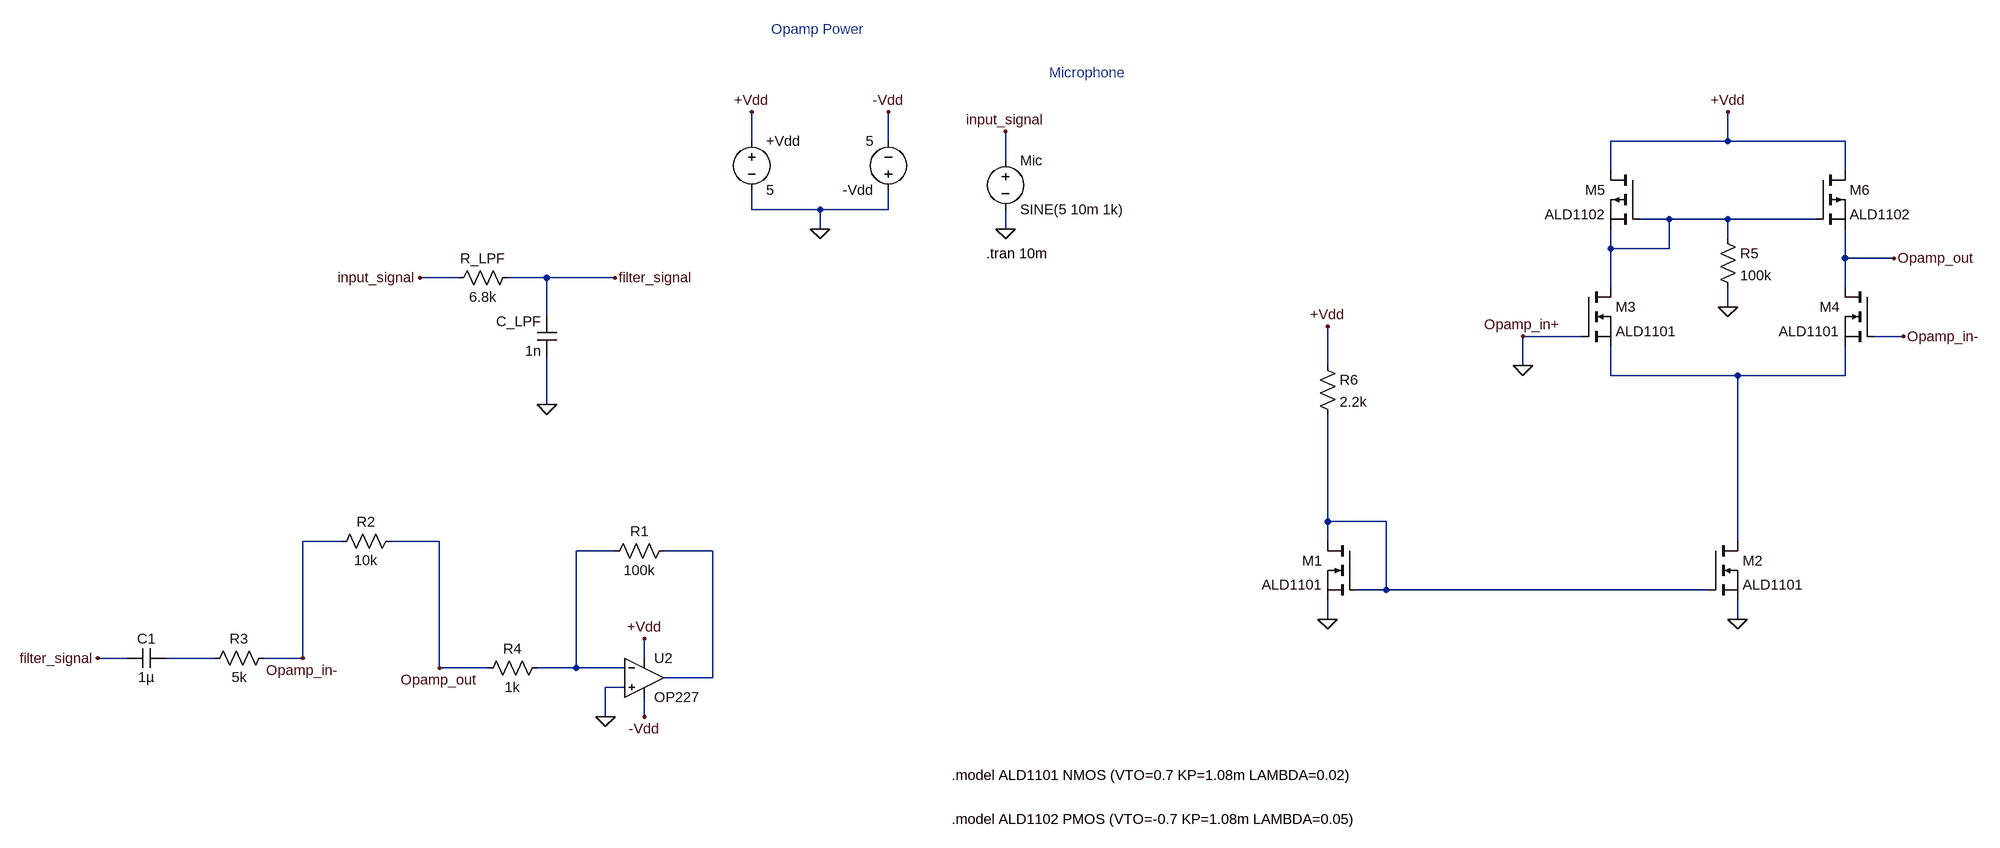
[diagram p0: schematic FinalProject_v2.asc]
FinalProject_v2.asc, the LTspice schematic file:
Version 4
SHEET 1 3908 1028
WIRE 576 -208 576 -256
WIRE 800 -208 800 -256
WIRE 2176 -208 2176 -256
WIRE 2176 -208 1984 -208
WIRE 2368 -208 2176 -208
WIRE 992 -176 992 -224
WIRE 1984 -160 1984 -208
WIRE 2368 -160 2368 -208
WIRE 576 -96 576 -128
WIRE 688 -96 576 -96
WIRE 800 -96 800 -128
WIRE 800 -96 688 -96
WIRE 2080 -80 2032 -80
WIRE 2176 -80 2080 -80
WIRE 2320 -80 2176 -80
WIRE 688 -64 688 -96
WIRE 992 -64 992 -96
WIRE 2176 -48 2176 -80
WIRE 1984 -32 1984 -64
WIRE 2080 -32 2080 -80
WIRE 2080 -32 1984 -32
WIRE 2368 -16 2368 -64
WIRE 2448 -16 2368 -16
WIRE 96 16 32 16
WIRE 240 16 176 16
WIRE 352 16 240 16
WIRE 1984 32 1984 -32
WIRE 2368 32 2368 -16
WIRE 2176 64 2176 32
WIRE 240 80 240 16
WIRE 1936 112 1840 112
WIRE 2464 112 2416 112
WIRE 1520 160 1520 96
WIRE 1840 160 1840 112
WIRE 1984 176 1984 128
WIRE 2192 176 1984 176
WIRE 2368 176 2368 128
WIRE 2368 176 2192 176
WIRE 240 224 240 144
WIRE 1520 416 1520 240
WIRE 1616 416 1520 416
WIRE -96 448 -160 448
WIRE 64 448 -16 448
WIRE 1520 448 1520 416
WIRE 2192 448 2192 176
WIRE 352 464 288 464
WIRE 512 464 432 464
WIRE 1616 528 1616 416
WIRE 1616 528 1568 528
WIRE 2144 528 1616 528
WIRE 1520 576 1520 544
WIRE 2192 576 2192 544
WIRE -448 640 -496 640
WIRE -304 640 -384 640
WIRE -160 640 -160 448
WIRE -160 640 -224 640
WIRE 400 640 400 608
WIRE 64 656 64 448
WIRE 144 656 64 656
WIRE 288 656 288 464
WIRE 288 656 224 656
WIRE 368 656 288 656
WIRE 512 672 512 464
WIRE 512 672 432 672
WIRE 368 688 336 688
WIRE 336 736 336 688
WIRE 400 736 400 704
FLAG 688 -64 0
FLAG 576 -256 +Vdd
FLAG 800 -256 -Vdd
FLAG 336 736 0
FLAG 400 608 +Vdd
FLAG 400 736 -Vdd
FLAG 992 -64 0
FLAG 992 -224 input_signal
FLAG 352 16 filter_signal
FLAG 32 16 input_signal
FLAG 240 224 0
FLAG -496 640 filter_signal
FLAG 2448 -16 Opamp_out
FLAG 1840 160 0
FLAG 2464 112 Opamp_in-
FLAG 64 656 Opamp_out
FLAG -160 640 Opamp_in-
FLAG 2176 -256 +Vdd
FLAG 1840 112 Opamp_in+
FLAG 1520 96 +Vdd
FLAG 1520 576 0
FLAG 2192 576 0
FLAG 2176 64 0
DATAFLAG 2192 320 "Id(M2)"
DATAFLAG 1520 336 "Id(M1)"
SYMBOL voltage 576 -224 R0
WINDOW 123 0 0 Left 0
WINDOW 39 0 0 Left 0
SYMATTR InstName +Vdd
SYMATTR Value 5
SYMBOL voltage 800 -112 R180
WINDOW 123 0 0 Left 0
WINDOW 39 0 0 Left 0
SYMATTR InstName -Vdd
SYMATTR Value 5
SYMBOL res 0 432 R90
WINDOW 0 0 56 VBottom 2
WINDOW 3 32 56 VTop 2
SYMATTR InstName R2
SYMATTR Value 10k
SYMBOL res -208 624 R90
WINDOW 0 0 56 VBottom 2
WINDOW 3 32 56 VTop 2
SYMATTR InstName R3
SYMATTR Value 5k
SYMBOL OpAmps\\OP227 400 608 R0
SYMATTR InstName U2
SYMBOL res 448 448 R90
WINDOW 0 0 56 VBottom 2
WINDOW 3 32 56 VTop 2
SYMATTR InstName R1
SYMATTR Value 100k
SYMBOL res 240 640 R90
WINDOW 0 0 56 VBottom 2
WINDOW 3 32 56 VTop 2
SYMATTR InstName R4
SYMATTR Value 1k
SYMBOL cap -384 624 R90
WINDOW 0 0 32 VBottom 2
WINDOW 3 32 32 VTop 2
SYMATTR InstName C1
SYMATTR Value 1µ
SYMBOL voltage 992 -192 R0
WINDOW 123 24 124 Left 2
WINDOW 39 0 0 Left 0
SYMATTR InstName Mic
SYMATTR Value SINE(5 10m 1k)
SYMBOL cap 256 144 R180
WINDOW 0 24 56 Left 2
WINDOW 3 24 8 Left 2
SYMATTR InstName C_LPF
SYMATTR Value 1n
SYMBOL res 192 0 R90
WINDOW 0 0 56 VBottom 2
WINDOW 3 32 56 VTop 2
SYMATTR InstName R_LPF
SYMATTR Value 6.8k
SYMBOL pmos 2032 -160 M0
SYMATTR InstName M5
SYMATTR Value ALD1102
SYMBOL pmos 2320 -160 R0
SYMATTR InstName M6
SYMATTR Value ALD1102
SYMBOL res 1504 144 R0
SYMATTR InstName R6
SYMATTR Value 2.2k
SYMBOL nmos 1568 448 M0
SYMATTR InstName M1
SYMATTR Value ALD1101
SYMBOL nmos 2144 448 R0
SYMATTR InstName M2
SYMATTR Value ALD1101
SYMBOL nmos 1936 32 R0
SYMATTR InstName M3
SYMATTR Value ALD1101
SYMBOL nmos 2416 32 M0
SYMATTR InstName M4
SYMATTR Value ALD1101
SYMBOL res 2160 -64 R0
SYMATTR InstName R5
SYMATTR Value 100k
TEXT 960 -24 Left 2 !.tran 10m
TEXT 1064 -320 Left 2 ;Microphone
TEXT 608 -392 Left 2 ;Opamp Power
TEXT 904 904 Left 2 !.model ALD1102 PMOS (VTO=-0.7 KP=1.08m LAMBDA=0.05)
TEXT 904 832 Left 2 !.model ALD1101 NMOS (VTO=0.7 KP=1.08m LAMBDA=0.02)

The netlist it stands for:
* FinalProject_v2.asc
V§+Vdd +Vdd 0 5
V§-Vdd 0 -Vdd 5
R2 Opamp_out Opamp_in- 10k
R3 Opamp_in- N006 5k
XU2 0 N004 +Vdd -Vdd N005 OP227  ; pins In+ In- V+ V- OUT
R1 N005 N004 100k
R4 N004 Opamp_out 1k
C1 N006 filter_signal 1µ
V§Mic input_signal 0 SINE(5 10m 1k)
C_LPF 0 filter_signal 1n
R_LPF filter_signal input_signal 6.8k
M5 +Vdd N001 N001 N001 ALD1102
M6 +Vdd N001 Opamp_out Opamp_out ALD1102
R6 +Vdd N003 2.2k
M1 N003 N003 0 0 ALD1101
M2 N002 N003 0 0 ALD1101
M3 N001 0 N002 N002 ALD1101
M4 Opamp_out Opamp_in- N002 N002 ALD1101
R5 N001 0 100k
.model NMOS NMOS
.model PMOS PMOS
.lib standard.mos
.tran 10m
* Microphone
* Opamp Power
.model ALD1102 PMOS (VTO=-0.7 KP=1.08m LAMBDA=0.05)
.model ALD1101 NMOS (VTO=0.7 KP=1.08m LAMBDA=0.02)
.backanno
.end